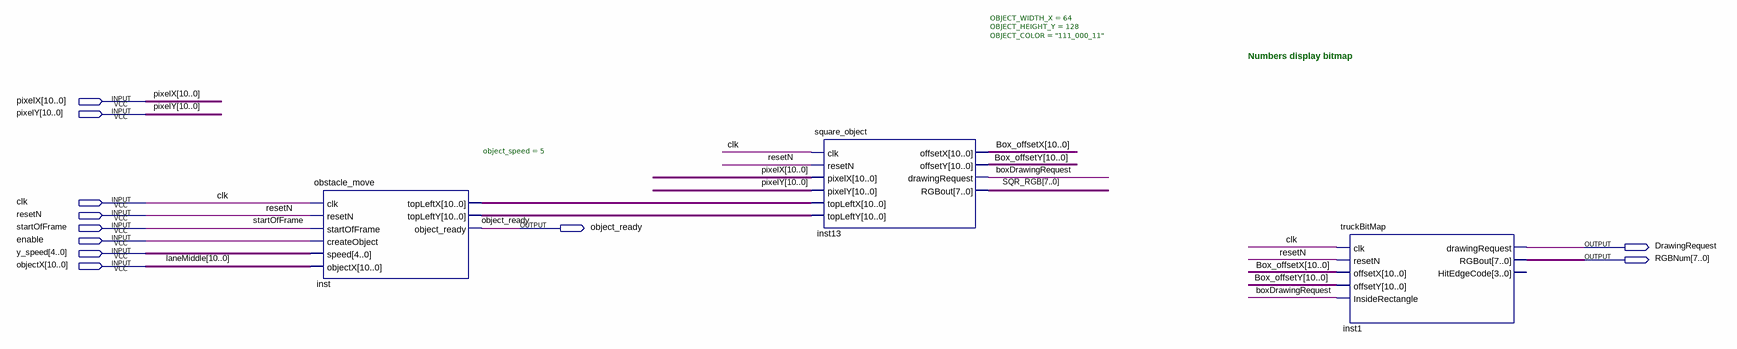
[diagram p0: schematic sheet]
// Quartus schematic truck_block.bdf as structural Verilog: 3 symbols, 11 pins
module truck_block (
  input  [10:0] pixelX,
  input  [10:0] pixelY,
  input  clk,
  input  resetN,
  input  startOfFrame,
  input  enable,
  input  [4:0] y_speed,
  input  [10:0] objectX,
  output object_ready,
  output DrawingRequest,
  output [7:0] RGBNum
);

  wire boxDrawingRequest;
  wire [7:0] SQR_RGB;
  wire [10:0] Box_offsetX, Box_offsetY, inst_topleftx, inst_toplefty;

  obstacle_move #(.object_speed(5)) inst (
    .clk(clk), .resetN(resetN), .startOfFrame(startOfFrame), .createObject(enable), .speed(y_speed),
    .objectX(objectX), .topLeftX(inst_topleftx), .topLeftY(inst_toplefty), .object_ready(object_ready));
  square_object #(.OBJECT_WIDTH_X(64), .OBJECT_HEIGHT_Y(128), .OBJECT_COLOR("111_000_11")) inst13 (
    .clk(clk), .resetN(resetN), .pixelX(pixelX), .pixelY(pixelY), .topLeftX(inst_topleftx),
    .topLeftY(inst_toplefty), .offsetX(Box_offsetX), .offsetY(Box_offsetY),
    .drawingRequest(boxDrawingRequest), .RGBout(SQR_RGB));
  truckBitMap inst1 (
    .clk(clk), .resetN(resetN), .offsetX(Box_offsetX), .offsetY(Box_offsetY),
    .InsideRectangle(boxDrawingRequest), .drawingRequest(DrawingRequest), .RGBout(RGBNum));  // open: HitEdgeCode

  // Other names for the same wires on the sheet: laneMiddle[10:0] = objectX

  // Notes on the sheet:
  //   Numbers display bitmap
endmodule
